# Altium schematic sheet Solenoids.SchDoc
size Letter; Organization: Altium Limited; Address1: L3, 12a Rodborough Rd; Address2: Frenchs Forest; Address3: NSW; Address4: Australia 2086
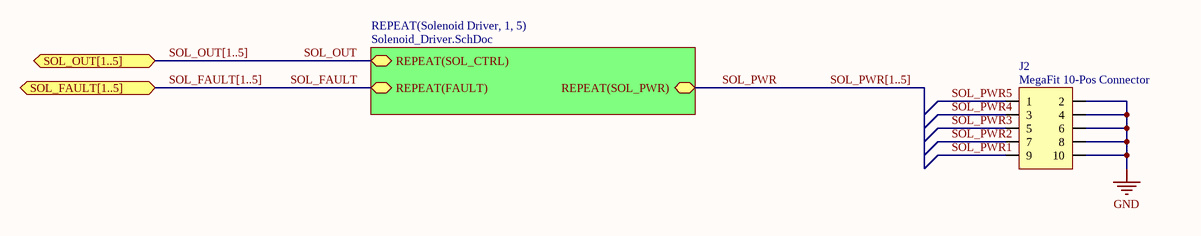
[diagram p0: Solenoids.SchDoc]

## Parts
J2  MegaFit 10-Pos Connector  [MegaFit-10Pos]

## Sub-sheets
REPEAT(Solenoid Driver, 1, 5) = Solenoid_Driver.SchDoc: REPEAT(FAULT) (bidir), REPEAT(SOL_CTRL) (bidir), REPEAT(SOL_PWR) (bidir)

## Ports
SOL_FAULT[1..5] (bidir), SOL_OUT[1..5] (bidir)

## Nets
GND: J2.2 J2.4 J2.6 J2.8 J2.10
SOL_FAULT: sheet REPEAT(Solenoid Driver, 1, 5)/REPEAT(FAULT)
SOL_OUT: sheet REPEAT(Solenoid Driver, 1, 5)/REPEAT(SOL_CTRL)
SOL_PWR: sheet REPEAT(Solenoid Driver, 1, 5)/REPEAT(SOL_PWR)
SOL_PWR1: J2.9
SOL_PWR2: J2.7
SOL_PWR3: J2.5
SOL_PWR4: J2.3
SOL_PWR5: J2.1

## Buses and harness runs
bus SOL_FAULT[1..5] = port SOL_FAULT[1..5]
bus SOL_OUT[1..5] = port SOL_OUT[1..5]
bus SOL_PWR[1..5]

## Notes on the sheet
- Title
- Size:
- Date:
- Letter
- Number:
- Time:
- Revision:
- Sheet
- of
- File:

## Library data of the parts
J2 = Mega-Fit 10Pos: Molex MegaFit 10-Pos Connector; URL: https://www.digikey.com/product-detail/en/molex-llc/0768290010/WM11979-ND/5639621; DigiKey PN: WM11979-ND